# Altium schematic sheet Leds and Buttons.SchDoc
size A; SheetNumber: 3; SheetTotal: 7
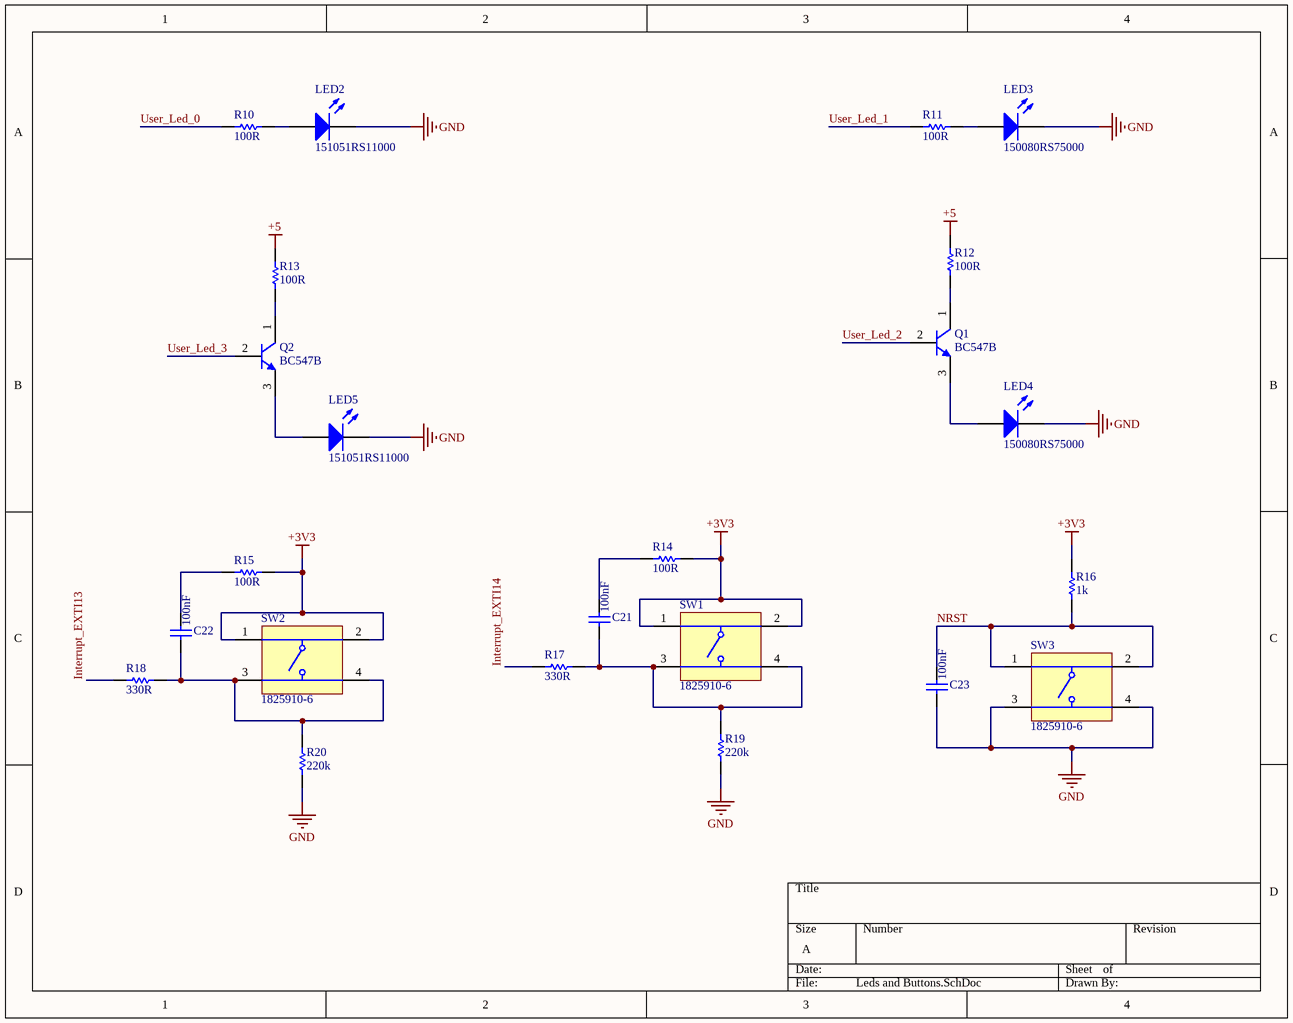
[diagram p0: Leds and Buttons.SchDoc]

## Parts
C21  value 100nF  [CAPC2013X135X45LL10T25]  (hidden comment: GRM21BR71H105KA12L)
C22  value 100nF  [CAPC2013X135X45LL10T25]  (hidden comment: GRM21BR71H105KA12L)
C23  value 100nF  [CAPC2013X135X45LL10T25]  (hidden comment: GRM21BR71H105KA12L)
LED2  151051RS11000  [Type 5mm]
LED3  150080RS75000  [0805_A]
LED4  150080RS75000  [0805_A]
LED5  151051RS11000  [Type 5mm]
Q1  BC547B  [ONSC-TO-92-3-29-11]
Q2  BC547B  [ONSC-TO-92-3-29-11]
R10  value 100R  [RESC2013X70X40NL20T20]  (hidden comment: ERJ6ENF47R0V)
R11  value 100R  [RESC2013X70X40NL20T20]  (hidden comment: ERJ6ENF47R0V)
R12  value 100R  [RESC2013X70X40NL20T20]  (hidden comment: ERJ6ENF47R0V)
R13  value 100R  [RESC2013X70X40NL20T20]  (hidden comment: ERJ6ENF47R0V)
R14  value 100R  [RESC2013X70X40NL20T20]  (hidden comment: ERJ6ENF47R0V)
R15  value 100R  [RESC2013X70X40NL20T20]  (hidden comment: ERJ6ENF47R0V)
R16  value 1k  [RESC2013X70X40NL20T20]  (hidden comment: ERJ6ENF47R0V)
R17  value 330R  [RESC2013X70X40NL20T20]  (hidden comment: ERJ6ENF47R0V)
R18  value 330R  [RESC2013X70X40NL20T20]  (hidden comment: ERJ6ENF47R0V)
R19  value 220k  [RESC2013X70X40NL20T20]  (hidden comment: ERJ6ENF47R0V)
R20  value 220k  [RESC2013X70X40NL20T20]  (hidden comment: ERJ6ENF47R0V)
SW1  1825910-6  [TECO-1825910-6_V]
SW2  1825910-6  [TECO-1825910-6_V]
SW3  1825910-6  [TECO-1825910-6_V]

## Nets
+3V3: R14.2 R15.2 R16.2 SW1.1 SW1.2 SW2.1 SW2.2
+5: R12.1 R13.1
GND: C23.1 LED2.1(K) LED3.1(K) LED4.1(K) LED5.1(K) R19.1 R20.1 SW3.3 SW3.4
Interrupt_EXTI13: R18.1
Interrupt_EXTI14: R17.1
NRST: C23.2 R16.1 SW3.1 SW3.2
User_Led_0: R10.1
User_Led_1: R11.1
User_Led_2: Q1.2(B)
User_Led_3: Q2.2(B)
NetC21_1: C21.1 R17.2 R19.2 SW1.3 SW1.4
NetC21_2: C21.2 R14.1
NetC22_1: C22.1 R18.2 R20.2 SW2.3 SW2.4
NetC22_2: C22.2 R15.1
NetLED2_2: LED2.2(A) R10.2
NetLED3_2: LED3.2(A) R11.2
NetLED4_2: LED4.2(A) Q1.3(E)
NetLED5_2: LED5.2(A) Q2.3(E)
NetQ1_1: Q1.1(C) R12.2
NetQ2_1: Q2.1(C) R13.2

## Library data of the parts
C21-C23 = CMP-1036-04761-2: Manufacturer: Murata; Part Number: GRM21BR71H105KA12L
LED2 LED5 = CMP-1488-00008-1: THT LED round mono-color color lens, WL-TMRW, Red; Manufacturer: Wuerth Elektronik; PackageReference: Type 5mm; PartNumber: 151051RS11000; ComponentLink2URL: http://katalog.we-online.de/pbs/datasheet/7448042001.pdfhttp://katalog.we-online.de/pbs/datasheet/7448042001.pdfhttp://katalog.we-online.de/pbs/datasheet/7448042001.pdfhttp://katalog.we-online.de/pbs/datasheet/151051RS11000.pdf; ComponentLink1URL: http://www.we-online.com; ComponentLink1Description: Manufacturer URL; ComponentLink2Description: Datasheet; Emitting color: Red
LED3 LED4 = CMP-1426-00011-1: SMD mono-color Chip LED, WL-SMCW, Red; Manufacturer: Wuerth Elektronik; Color: Red; PartNumber: 150080RS75000; PackageReference: 0805_A; ComponentLink2Description: Datasheet; ComponentLink1URL: http://www.we-online.com; ComponentLink1Description: Manufacturer URL; ComponentLink2URL: http://katalog.we-online.com/led/datasheet/150080RS75000.pdf
Q1 Q2 = CMP-1048-01467-1: Amplifier Transistor, NPN Silicon, 3-Pin TO-92, Bulk Box; Manufacturer: On Semiconductor; IC Continuous (A): 0.1; fT Min (MHz): 150; DatasheetVersion: Rev. 7; ComponentLink1URL: http://www.onsemi.com/; Polarity: NPN; RoHS: FALSE; ComponentLink1Description: Manufacturer URL; Packing: Bulk Box; PackageDescription: 3-Pin Transistor Outline, Body 4.825 x 3.685 mm, Pitch 1.27 mm; ComponentLink3URL: http://www.onsemi.cn/pub_link/Collateral/2N6426-D.PDF; ComponentLink2Description: Datasheet; PackageVersion: Rev. AM; PackageReference: TO-92-3-29-11_AM_SL; ComponentLink3Description: Package Specification; Mounting Technology: Through Hole; PartNumber: BC547B; ComponentLink2URL: http://www.onsemi.com/pub_link/Collateral/BC546-D.PDF
R10-R20 = CMP-2001-00205-1: Manufacturer: Panasonic; Part Number: ERJ6ENF47R0V
SW1-SW3 = CMP-1684-00021-1: Tact Switch, SPST-NO, 0.05 A, -35 to 85 degC, 4-Pin THD, RoHS, Bulk; Manufacturer: TE Connectivity; Maximum Contact Resistance: 100mOhm; Mechanical Life: 100000Cycles; Bushing Type: Unthreaded; Switch Configuration: OFF(ON); Maximum DC Voltage Rating: 24V; Contact Rating @ Voltage: 0.05A@24VDC; Actuator Color: Black; Body Orientation: Straight; Function: MomentaryContact; Illumination: N/R; Actuator Style: RoundButton; Actuator Material: PolybutyleneTerephthalate; Dielectric Strength: 500VAC; Pole Throw Configuration: SPST; Actuator Length: 1.4mm; Product Weight: N/A; Contact Material: CopperAlloy; Housing Material: N/A; Terminal Type: PCPins; Minimum Insulation Resistance: 100MOhm; Package Description: 4-Pin Through Hole Device, Body 5.99 x 5.99 mm, Pitch 6.5 mm; Part No: 1825910-6; Package Reference: THD; Base Material: N/A; Manufacturer URL: http://www.te.com; Contact Plating: Silver; RoHS: Yes; Datasheet Version: Rev. C9; Electrical Life: 100000Cycles; Maximum AC Voltage Rating: N/A; Thread Size: N/R; Operating Temperature: -35to85C; Mounting: ThroughHole; Dimension: 5.99x5mm; Datasheet URL: http://www.te.com/commerce/DocumentDelivery/DDEController?Action=showdoc&DocId=Customer+Drawing%7F1825910%7FC9%7Fpdf%7FEnglish%7FENG_CD_1825910_C9.pdf%7F1825910-6; Family: 1825910; Seal Location: N/A; Seal Description: N/A; Packaging: N/A